# EAGLE design Dramco UNO (EAGLE 7.3.0)

## Sheet 1 of 2
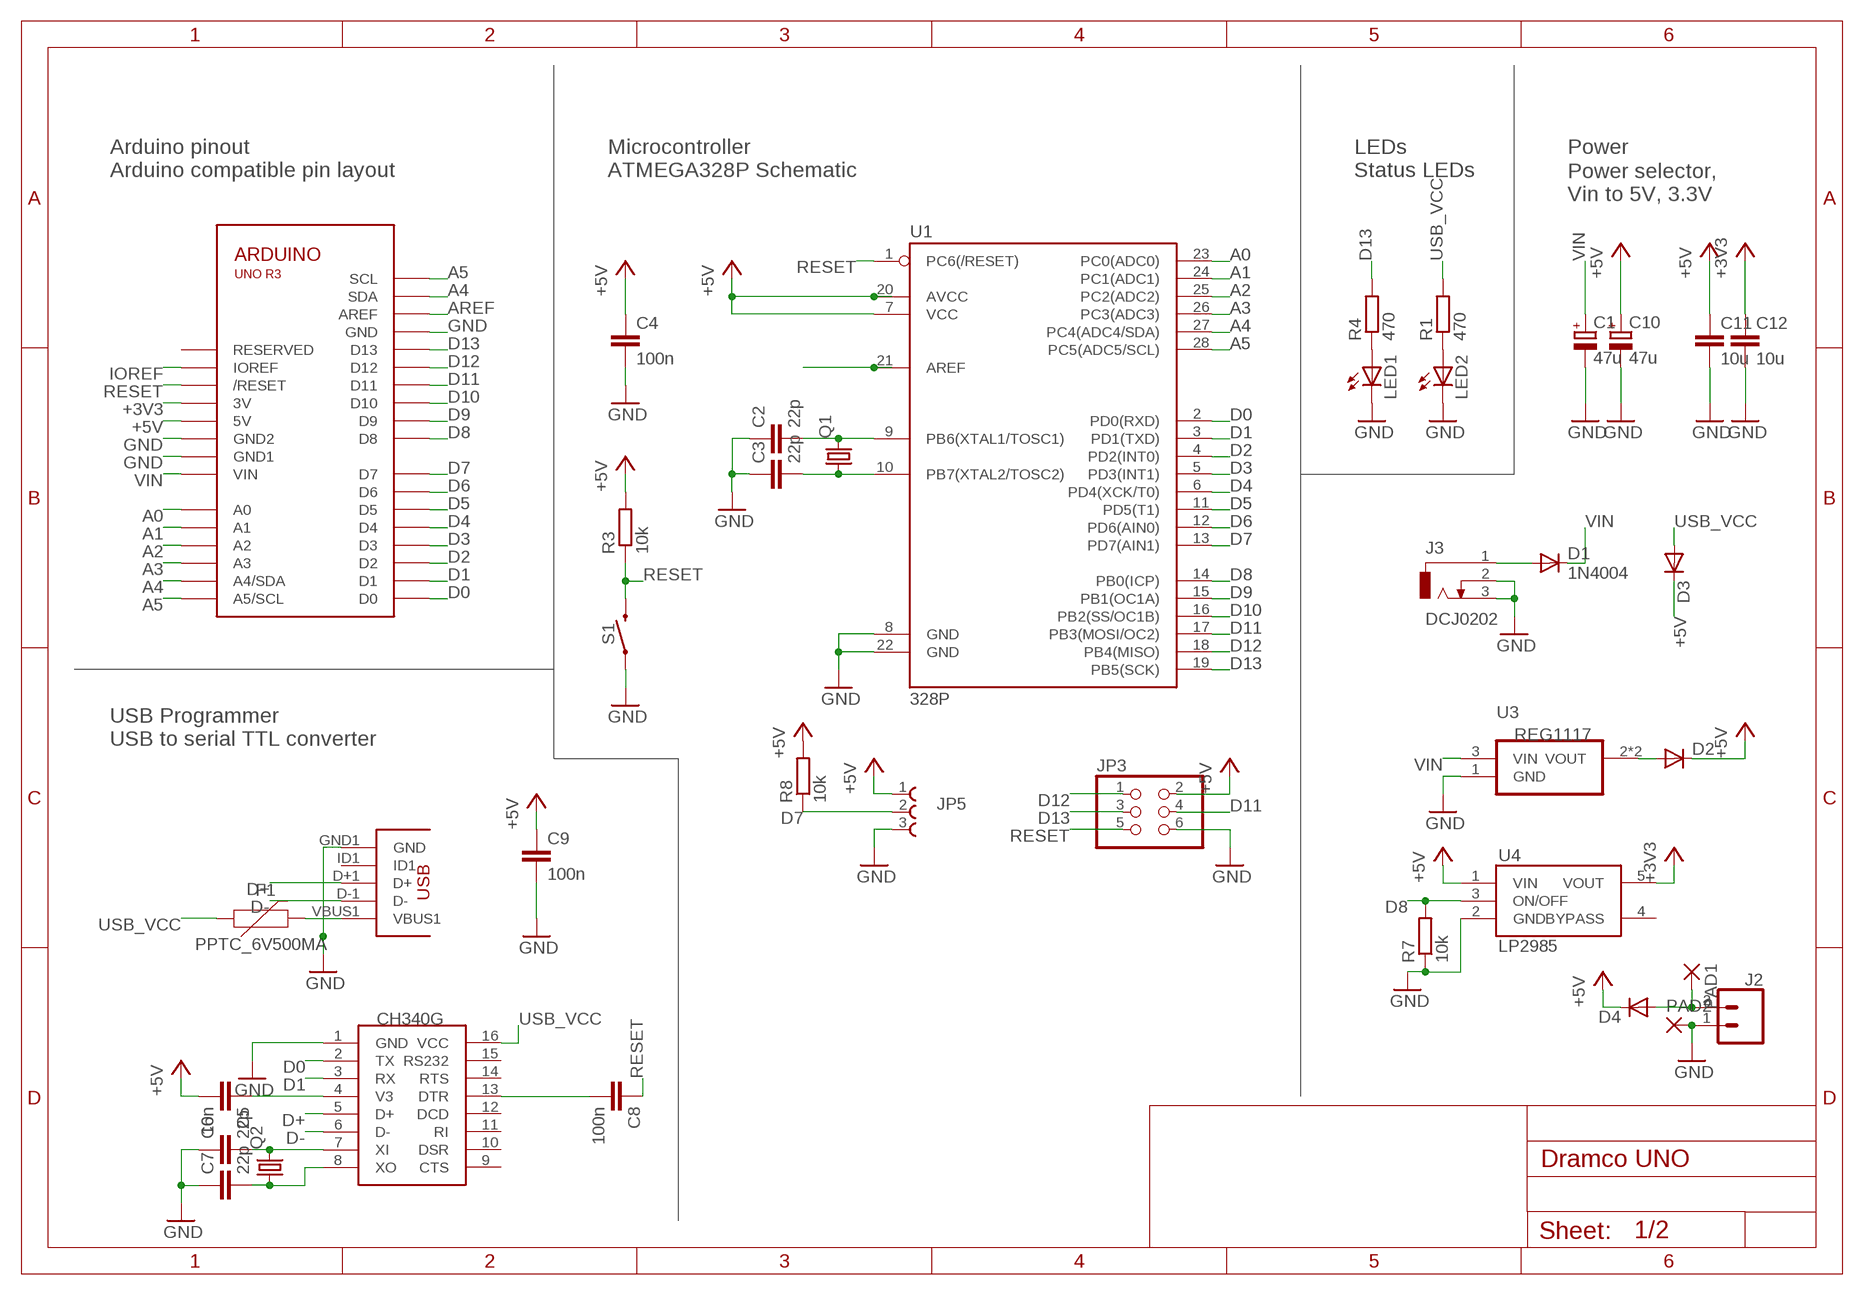
[diagram p0: schematic, sheet 1]

### Parts
C1  47u  CPOL-EUE2.5-6  [E2,5-6]
C2  22p  C-EU025-024X044  [C025-024X044]
C3  22p  C-EU025-024X044  [C025-024X044]
C4  100n  C-EU025-024X044  [C025-024X044]
C5  10n  C-EUC0603  [C0603]
C6  22p  C-EUC0603  [C0603]
C7  22p  C-EUC0603  [C0603]
C8  100n  C-EUC0603  [C0603]
C9  100n  C-EUC0603  [C0603]
C10  47u  CPOL-EUE2.5-6  [E2,5-6]
C11  10u  C-EUC0603  [C0603]
C12  10u  C-EUC0603  [C0603]
D1  1N4004  [DO41-10]
D2  DIODE-SOD123  [SOD123]
D3  DIODE-SOD123  [SOD123]
D4  DIODE-SOD123  [SOD123]
F1  PPTC_6V500MA  [0805]
J1  USB-AB  [USB-AB-MICRO-SMD_V02_BOSS]
J2  CONN_02JST-PTH-2  [JST-2-PTH]
J3  DCJ0202  [DCJ0202]
JP1  ARDUINOR3-DIMENSION  [ARDUINOR3]
JP3  PINHD-2X3  [2X03]
JP5  691210910003  [691210910003]
LED1  LED5MM  [LED5MM]
LED2  LED5MM  [LED5MM]
PAD1  SMD2  [SMD1,27-2,54]
PAD2  SMD2  [SMD1,27-2,54]
Q1  CRYSTALHC49S  [HC49/S]
Q2  CRYSTALHC49S  [HC49/S]
R1  470  R-EU_0204/7  [0204/7]
R3  10k  R-EU_0204/7  [0204/7]
R4  470  R-EU_0204/7  [0204/7]
R7  10k  R-EU_R0603  [R0603]
R8  10k  R-EU_0204/7  [0204/7]
S1  MOMENTARY-SWITCH-SPST-PTH-6.0MM  [TACTILE_SWITCH_PTH_6.0MM]
U1  328P  ATMEGA328P_PDIP  [DIP28]
U2  CH340G  [SOIC16]
U3  REG1117  [SOT223]
U4  LP2985AIM5-3.3  [SOT25]

### Nets
+3V3: C12.1 JP1.3V U4.5(VOUT) ; also sheet 2
+5V: C4.1 C5.2 C9.1 C10.+ C11.1 D2.C D3.C D4.C JP1.5V JP3.2 JP5.1 R3.2 R8.2 U1.7(VCC) U1.20(AVCC) U4.1(VIN) ; also sheet 2
A0: JP1.A0 U1.23(PC0(ADC0))
A1: JP1.A1 U1.24(PC1(ADC1))
A2: JP1.A2 U1.25(PC2(ADC2))
A3: JP1.A3 U1.26(PC3(ADC3))
A4: JP1.A4(A4/SDA) JP1.SDA U1.27(PC4(ADC4/SDA)) ; also sheet 2
A5: JP1.A5(A5/SCL) JP1.SCL U1.28(PC5(ADC5/SCL)) ; also sheet 2
AREF: JP1.AREF U1.21(AREF)
D0: JP1.D0 U1.2(PD0(RXD)) U2.2(TX)
D1: JP1.D1 U1.3(PD1(TXD)) U2.3(RX)
D2: JP1.D2 U1.4(PD2(INT0)) ; also sheet 2
D3: JP1.D3 U1.5(PD3(INT1)) ; also sheet 2
D4: JP1.D4 U1.6(PD4(XCK/T0)) ; also sheet 2
D5: JP1.D5 U1.11(PD5(T1)) ; also sheet 2
D6: JP1.D6 U1.12(PD6(AIN0)) ; also sheet 2
D7: JP1.D7 JP5.2 R8.1 U1.13(PD7(AIN1))
D8: JP1.D8 R7.2 U1.14(PB0(ICP)) U4.3(ON/OFF)
D9: JP1.D9 U1.15(PB1(OC1A)) ; also sheet 2
D10: JP1.D10 U1.16(PB2(SS/OC1B))
D11: JP1.D11 JP3.4 U1.17(PB3(MOSI/OC2)) ; also sheet 2
D12: JP1.D12 JP3.1 U1.18(PB4(MISO)) ; also sheet 2
D13: JP1.D13 JP3.3 R4.2 U1.19(PB5(SCK)) ; also sheet 2
D+: J1.D+1(D+) U2.5(D+)
D-: J1.D-1(D-) U2.6(D-)
GND: C1.- C2.1 C3.1 C4.2 C6.1 C7.1 C9.2 C10.- C11.2 C12.2 J1.GND1(GND) J2.1 J3.2 J3.3 JP1.GND JP1.GND1 JP1.GND2 JP3.6 JP5.3 LED1.K(C) LED2.K(C) PAD2.1(P) R7.1 S1.1 U1.8(GND) U1.22(GND) U2.1(GND) U3.1(GND) U4.2(GND) ; also sheet 2
IOREF: JP1.IOREF
N$1: C2.2 Q1.2 U1.9(PB6(XTAL1/TOSC1))
N$2: C3.2 Q1.1 U1.10(PB7(XTAL2/TOSC2))
N$3: C6.2 Q2.2 U2.7(XI)
N$4: C7.2 Q2.1 U2.8(XO)
N$5: C5.1 U2.4(V3)
N$6: LED1.A R4.1
N$7: LED2.A R1.1
N$8: C8.2 U2.13(DTR)
N$9: D2.A U3.2(VOUT) U3.4(VOUT)
N$10: F1.2 J1.VBUS1
N$13: D1.A J3.1
RESET: C8.1 JP1.RESET(/RESET) JP3.5 R3.1 S1.3 U1.1(PC6(/RESET))
USB_VCC: D3.A F1.1 R1.2 U2.16(VCC)
VBAT: D4.A J2.2 PAD1.1(P)
VIN: C1.+ D1.C JP1.VIN U3.3(VIN)
Unconnected: J1.ID1 JP1.RESERVED U2.9(CTS) U2.10(DSR) U2.11(RI) U2.12(DCD) U2.14(RTS) U2.15(RS232) U4.4(BYPASS)

### Notes on the sheet
- Arduino pinout | Microcontroller | LEDs | Power
- Power selector, 
  Vin to 5V, 3.3V
- Arduino compatible pin layout | ATMEGA328P Schematic | Status LEDs
- USB Programmer
- USB to serial TTL converter

## Sheet 2 of 2
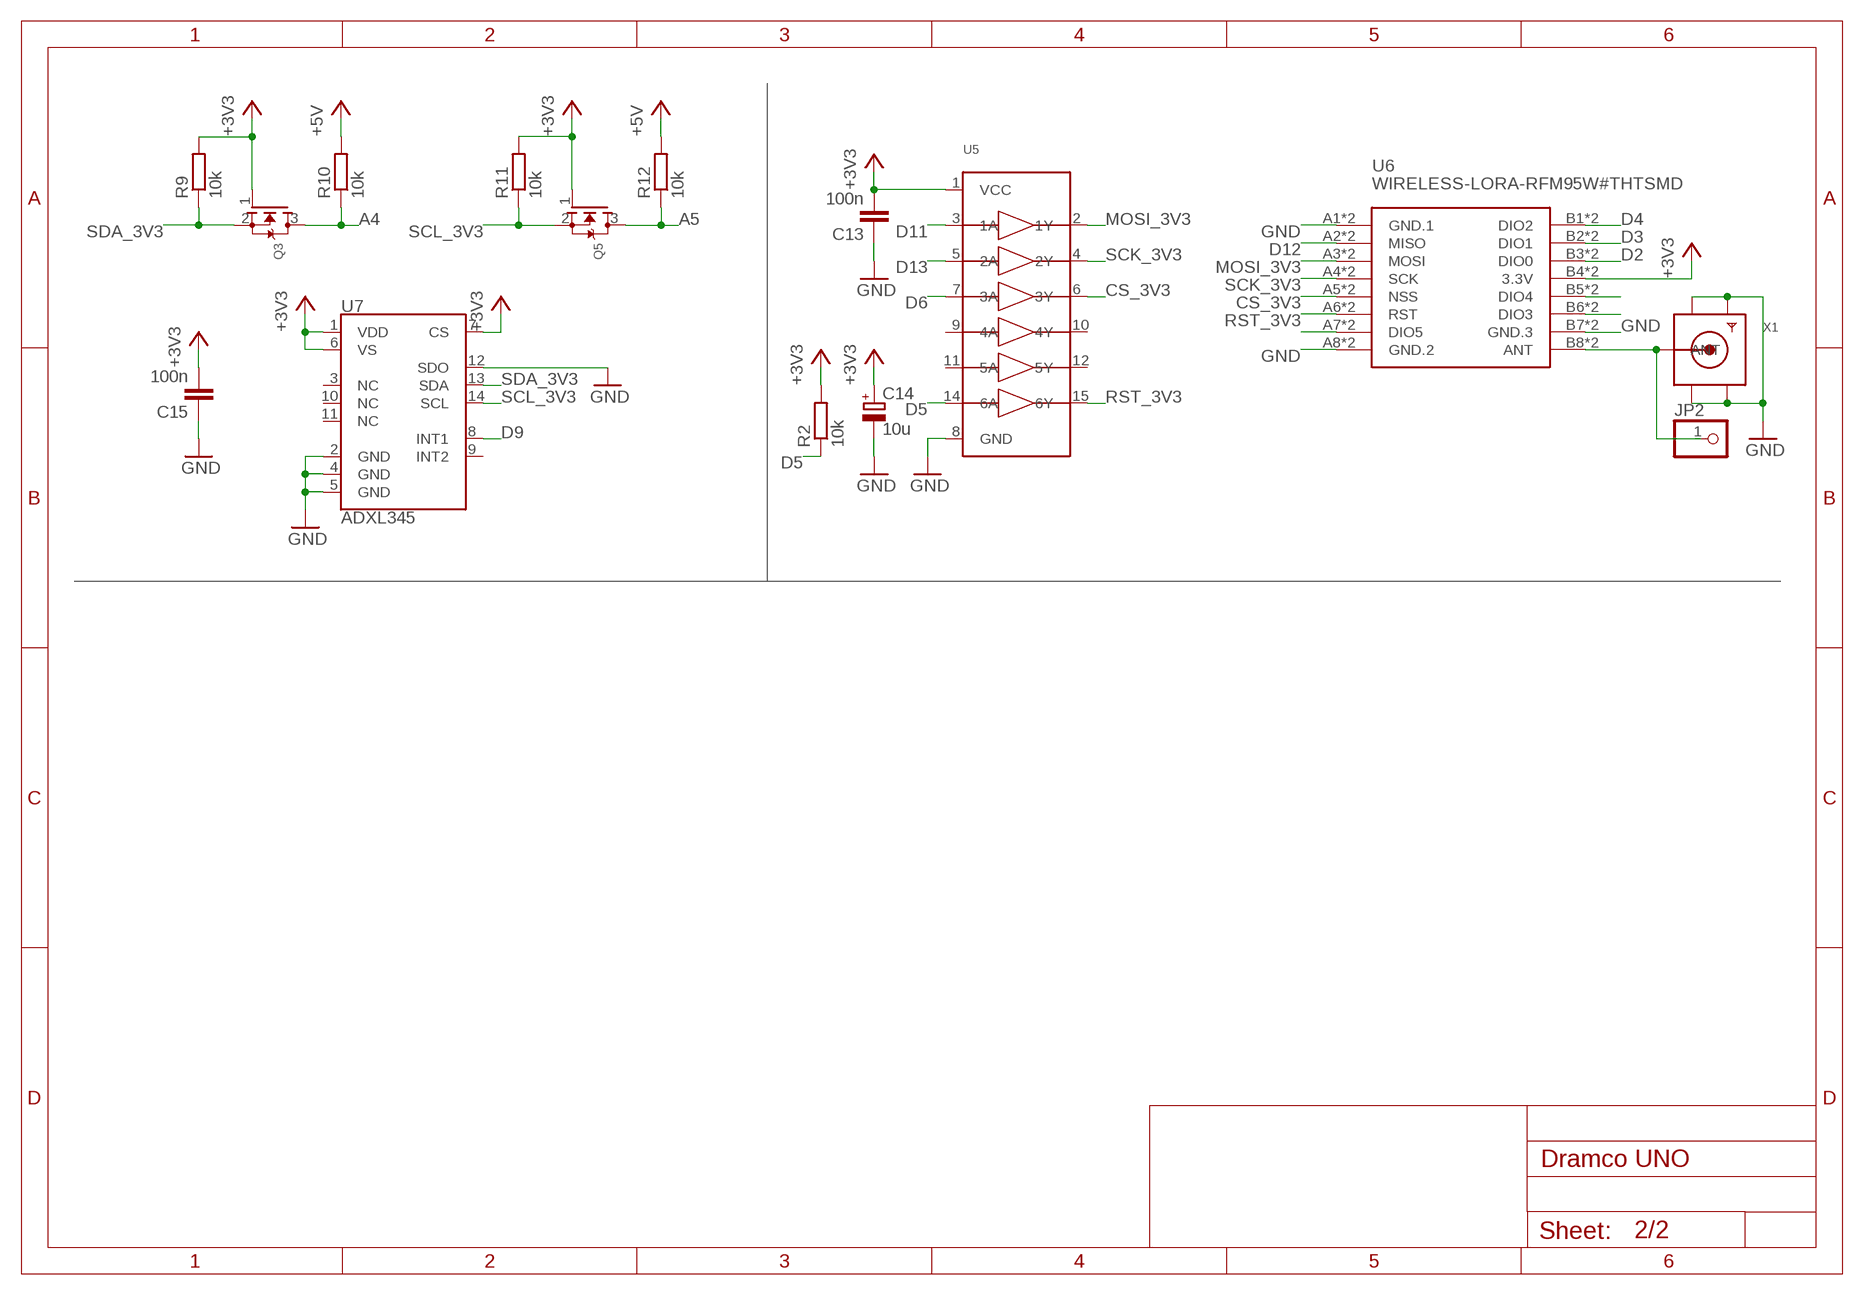
[diagram p1: schematic, sheet 2]

### Parts
C13  100n  C-EUC0603  [C0603]
C14  10u  CPOL-EUE2-4  [E2-4]
C15  100n  C-EUC0603  [C0603]
JP2  PINHD-1X1  [1X01]
Q3  MOSFET-NREFLOW  [SOT23]
Q5  MOSFET-NREFLOW  [SOT23]
R2  10k  R-EU_R0603  [R0603]
R9  10k  R-EU_R0603  [R0603]
R10  10k  R-EU_R0603  [R0603]
R11  10k  R-EU_R0603  [R0603]
R12  10k  R-EU_R0603  [R0603]
U5  74HC4050DTSSOP  [TSSOP16]
U6  WIRELESS-LORA-RFM95W#THTSMD  [WIRELESS-LORA-RFM95W#THTSMD]
U7  ADXL345  [LGA-14]
X1  SMACONNECTOR_EDGE_UFL  [SMA_EDGELAUNCH_UFL]

### Nets
+3V3: C13.2 C14.+ C15.2 Q3.1(G) Q5.1(G) R2.2 R9.2 R11.2 U5.1(VCC) U6.B4(3.3V) U6.B12(3.3V) U7.1(VDD) U7.6(VS) U7.7(CS) ; also sheet 1
+5V: R10.2 R12.2 ; also sheet 1
A4: Q3.3(D) R10.1 ; also sheet 1
A5: Q5.3(D) R12.1 ; also sheet 1
CS_3V3: U5.6(3Y) U6.A5(NSS) U6.A13(NSS)
D2: U6.B3(DIO0) U6.B11(DIO0) ; also sheet 1
D3: U6.B2(DIO1) U6.B10(DIO1) ; also sheet 1
D4: U6.B1(DIO2) U6.B9(DIO2) ; also sheet 1
D5: R2.1 U5.14(6A) ; also sheet 1
D6: U5.7(3A) ; also sheet 1
D9: U7.8(INT1) ; also sheet 1
D11: U5.3(1A) ; also sheet 1
D12: U6.A2(MISO) U6.A10(MISO) ; also sheet 1
D13: U5.5(2A) ; also sheet 1
GND: C13.1 C14.- C15.1 U5.8(GND) U6.A1(GND.1) U6.A8(GND.2) U6.A9(GND.1) U6.A16(GND.2) U6.B7(GND.3) U6.B15(GND.3) U7.2(GND) U7.4(GND) U7.5(GND) U7.12(SDO) X1.GND@1(GND1) X1.GND@2(GND2) X1.GND@3(GND3) X1.GND@4(GND4) ; also sheet 1
MOSI_3V3: U5.2(1Y) U6.A3(MOSI) U6.A11(MOSI)
N$11: JP2.1 U6.B8(ANT) U6.B16(ANT) X1.P(ANT)
N$25: U6.A7(DIO5) U6.A15(DIO5)
N$30: U6.B5(DIO4) U6.B13(DIO4)
N$31: U6.B6(DIO3) U6.B14(DIO3)
RST_3V3: U5.15(6Y) U6.A6(RST) U6.A14(RST)
SCK_3V3: U5.4(2Y) U6.A4(SCK) U6.A12(SCK)
SCL_3V3: Q5.2(S) R11.1 U7.14(SCL)
SDA_3V3: Q3.2(S) R9.1 U7.13(SDA)
Unconnected: U5.9(4A) U5.10(4Y) U5.11(5A) U5.12(5Y) U7.3(NC) U7.9(INT2) U7.10(NC) U7.11(NC)

## Library data of the parts
C1 C10 C14 = rcl:CPOL-EU: POLARIZED CAPACITOR, European symbol
C2-C9 = resistor:C-EU: CAPACITOR, European symbol
C11-C13 C15 = rcl:C-EU: CAPACITOR, European symbol
D1 = diode:1N4004: DIODE general purpose rectifier, 1 A
D2-D4 = diode:DIODE-: DIODE
F1 = SparkFun-Fuses:PPTC: Resettable Fuse PPTC Resettable Fuse. Really a sort of resistor with a polymeric positive temperature coefficient whose resistance increases dramatically with an increase in temperature. When heated by the power passing through the resistance rises causing the current to be limited, protecting the circuit. This is achieved by the transition of the polymer from a crystalline to an amorphous state where the conductive carbon separates breaking the conductive pathways found in the cool crystalline structure. When a PPTC cools back down it resumes conducting letting the circuit turn back on. SparkFun Products: SparkFun RedBoard - Programmed with Arduino <https://www.sparkfun.com/products/12757> Pro Micro - 5V/16MHz <https://www.sparkfun.com/products/12640> Arduino Pro 328 - 5V/16MHz <https://www.sparkfun.com/products/10915> MP3 Trigger <https://www.sparkfun.com/products/13720>
J1 = Testing:USB-AB
J2 = SparkFun-Connectors:CONN_02: Multi connection point. Often used as Generic Header-pin footprint for 0.1 inch spaced/style header connections On any of the 0.1 inch spaced packages, you can populate with these: Break Away Headers - Straight <https://www.sparkfun.com/products/116> (PRT-00116) Break Away Male Headers - Right Angle <https://www.sparkfun.com/products/553> (PRT-00553) Female Headers <https://www.sparkfun.com/products/115> (PRT-00115) Break Away Headers - Machine Pin <https://www.sparkfun.com/products/117> (PRT-00117) Break Away Female Headers - Swiss Machine Pin <https://www.sparkfun.com/products/743> (PRT-00743) For SCREWTERMINALS and SPRING TERMINALS visit here: Screw Terimnals on SparkFun.com <https://www.sparkfun.com/search/results?term=Screw+Terminals> (5mm/3.5mm/2.54mm spacing) This device is also useful as a general connection point to wire up your design to another part of your project. Our various solder wires solder well into these plated through hole pads. Hook-Up Wire - Assortment (Stranded, 22 AWG) <https://www.sparkfun.com/products/11375> (PRT-11375) Hook-Up Wire - Assortment (Solid Core, 22 AWG) <https://www.sparkfun.com/products/11367> (PRT-11367) View the entire wire category on our website here <https://www.sparkfun.com/categories/141> Special notes: Molex polarized connector foot print use with: PRT-08233 with associated crimp pins and housings. 2.54_SCREWTERM for use with PRT-10571. 3.5mm Screw Terminal footprints for PRT-08084 5mm Screw Terminal footprints for use with PRT-08432; PROD_ID: CONN-09863; SKU: PRT-09914
J3 = con-jack:DCJ0202: DC POWER JACK Source: DCJ0202.pdf; OC_FARNELL: unknown; OC_NEWARK: unknown
JP1 = adafruit:ARDUINOR3: This is a new object for the new Arduino R3 - with extra pins that you may want to use (such as IOref, and duplicated A4/A5
JP2 = pinhead:PINHD-1X1: PIN HEADER
JP3 = pinhead:PINHD-2X3: PIN HEADER
JP5 = TerminalBlocks (rev17a):691210910003: WR-TBL Serie 2109 - 2.54mm Horizontal Entry Modular with Rising Cage Clamp - 0.8mm2 Wires, 3 Pins=>Code : Con_TBL_Screw_RisingClamp_2.54_691210910003 <http://katalog.we-online.de/media/images/eican/Con_TBL_Screw_RisingClamp_2.54_6912109100xx_pf2.jpg> Details see: http://katalog.we-online.de/en/em/TBL_2_54_2109_HORIZONTAL_ENTRY_69121091000X Created 2014-06-17, Karrer Zheng 2014 (C) Würth Elektronik
LED1 LED2 = adafruit:LED: LED OSRAM: - CHIPLED LG R971, LG N971, LY N971, LG Q971, LY Q971, LO R971, LY R971 LH N974, LH R974 LS Q976, LO Q976, LY Q976 LO Q996 - Hyper CHIPLED LW Q18S LB Q993, LB Q99A, LB R99A - SideLED LS A670, LO A670, LY A670, LG A670, LP A670 LB A673, LV A673, LT A673, LW A673 LH A674 LY A675 LS A676, LA A676, LO A676, LY A676, LW A676 LS A679, LY A679, LG A679 - Hyper Micro SIDELED® LS Y876, LA Y876, LO Y876, LY Y876 LT Y87S - SmartLED LW L88C, LW L88S LB L89C, LB L89S, LG L890 LS L89K, LO L89K, LY L89K LS L896, LA L896, LO L896, LY L896 - TOPLED LS T670, LO T670, LY T670, LG T670, LP T670 LSG T670, LSP T670, LSY T670, LOP T670, LYG T670 LG T671, LOG T671, LSG T671 LB T673, LV T673, LT T673, LW T673 LH T674 LS T676, LA T676, LO T676, LY T676, LB T676, LH T676, LSB T676, LW T676 LB T67C, LV T67C, LT T67C, LS T67K, LO T67K, LY T67K, LW E67C LS E67B, LA E67B, LO E67B, LY E67B, LB E67C, LV E67C, LT E67C LW T67C LS T679, LY T679, LG T679 LS T770, LO T770, LY T770, LG T770, LP T770 LB T773, LV T773, LT T773, LW T773 LH T774 LS E675, LA E675, LY E675, LS T675 LS T776, LA T776, LO T776, LY T776, LB T776 LHGB T686 LT T68C, LB T68C - Hyper Mini TOPLED® LB M676 - Mini TOPLED Santana® LG M470 LS M47K, LO M47K, LY M47K Source: http://www.osram.convergy.de/
PAD1 PAD2 = wirepad:SMD2: SMD PAD
Q1 Q2 = adafruit:CRYSTAL: CRYSTAL; OC_FARNELL: 1667008; OC_NEWARK: unknown
Q3 Q5 = adafruit:MOSFET-N: N-Channel Mosfet 2N7002E - 60V 260mA SOT23 [Digikey: 2N7002ET1GOSTR-ND] - REEL BSH103 - 30V 850mA SOT23 [Digikey: 568-5013-1-ND]
R1 R3 R4 R8 = resistor:R-EU_: RESISTOR, European symbol
R2 R7 R9-R12 = rcl:R-EU_: RESISTOR, European symbol
S1 = SparkFun-Switches:MOMENTARY-SWITCH-SPST: Momentary Switch (Pushbutton) - SPST Normally-open (NO) SPST momentary switches (buttons, pushbuttons). Variants PTH-12MM - 12mm square, through-hole Momentary Pushbutton Switch - 12mm Square <https://www.sparkfun.com/products/9190> (COM-09190) PTH-6.0MM, PTH-6.0MM-KIT - 6.0mm square, through-hole Mini Pushbutton Switch <https://www.sparkfun.com/products/97> (COM-00097) KIT package intended for soldering kit's - only one side of pads' copper is exposed. PTH-RIGHT-ANGLE-KIT - Right-angle, through-hole Right Angle Tactile Button <https://www.sparkfun.com/products/10791> - Used on SparkFun BigTime Watch Kit <https://www.sparkfun.com/products/11734> SMD-12MM - 12mm square, surface-mount Tactile Button - SMD (12mm) <https://www.sparkfun.com/products/12993> (COM-12993) Used on SparkFun PicoBoard <https://www.sparkfun.com/products/11888> SMD-4.5MM - 4.5mm Square Trackball Switch Used on SparkFun Blackberry Trackballer Breakout <https://www.sparkfun.com/products/13169> SMD-4.6MMX2.8MM - 4.60mm x 2.80mm, surface mount Used on SparkFun SAMD21 Mini Breakout <https://www.sparkfun.com/products/13664> SMD-5.2MM, SMD-5.2-REDUNDANT - 5.2mm square, surface-mount Mini Pushbutton Switch - SMD <https://www.sparkfun.com/products/8720> (COM-08720) Used on Arduino Pro Mini <https://www.sparkfun.com/products/11114> REDUNDANT package connects both switch circuits together SMD-6.0X3.5MM - 6.0 x 3.5mm, surface mount Momentary Reset Switch SMD <https://www.sparkfun.com/products/8229> (COM-08229) SMD-6.2MM-TALL - 6.2mm square, surface mount Tactile Button - SMD (6mm) <https://www.sparkfun.com/products/12992> Used on SparkFun Digital Sandbox <https://www.sparkfun.com/products/12651> SMD-RIGHT-ANGLE - Right-angle, surface mount Used on SparkFun Block for Intel® Edison - Arduino <https://www.sparkfun.com/products/13036>; PROD_ID: SWCH-08441; SF_SKU: COM-00097
U1 = SparkFun-IC-Microcontroller:ATMEGA328P_PDIP: Atmel 328P Through hole ATMEGA328P uC used in the Arduino 32kb flash, 1k EEPROM, 2k SRAM Datasheet <http://www.sparkfun.com/datasheets/Components/SMD/ATMega328.pdf> SparkFun Products Storefront component: AVR 28 Pin 20MHz 32K 6A/D - ATMega328P <https://www.sparkfun.com/products/9061> (COM-09061) SparkFun Simon Says - Through-Hole Soldering Kit <https://www.sparkfun.com/products/10547> (KIT-10547) SparkFun Learn to Solder - Simon Says <https://www.sparkfun.com/products/13708> (KIT-13708) SparkFun BigTime Watch Kit <https://www.sparkfun.com/products/11734> (KIT-11734) SparkFun ClockIt <https://www.sparkfun.com/products/10930> (KIT-10930) SparkFun Serial Enabled LCD Kit <https://www.sparkfun.com/products/10097> (LCD-10097) SparkFun Simon Tilts - Through Hole Soldering Kit <https://www.sparkfun.com/products/12634> (KIT-12634) SparkFun Frequency Counter Kit <https://www.sparkfun.com/products/10140> (KIT-10140) FabFM Radio Kit <https://www.sparkfun.com/products/11043> (KIT-11043) SparkFun Binary Blaster Kit <https://www.sparkfun.com/products/12037> (KIT-12037) SparkFun Metro-Gnome <https://www.sparkfun.com/products/9236> (KIT-09236) ATmega328 with Arduino Optiboot (Uno) <https://www.sparkfun.com/products/10524> (DEV-10524); PROD_ID: IC-09136
U2 = ch340g:CH340G
U3 = burr-brown:REG1117: 800mA and 1A Low Dropout (LDO) Positive Regulator 1.8V, 2.5V, 2.85V, 3.3V, 5V, and Adj; MPN: REG1117; OC_FARNELL: 1097566; OC_NEWARK: 14P6981
U4 = LP2985:LP2985: LP2985-N Micropower 150 mA Low-Noise Ultra Low-Dropout Regulator
U5 = microbuilder:74HC4050D: 6-channel level shifter 74HC4050D - 2V-6V Supply SOIC16 Digikey: 74HC4050D,653-ND Mouser: 771-74HC4050D-T TSSOP16 Digikey: 296-9215-1-ND Mouser:
U6 = diy-modules:WIRELESS-LORA-RFM95W: 868/915 MHz LoRa Radio Transceiver Module based on SX1276 chip Click here to find device on ebay.com <http://www.ebay.com/sch/RFM95W+transceiver>
U7 = SparkFun-Sensors:ADXL345: Analog Devices ADXL345 3-Axis SPI/I2C 2/4/8/16g Accelerometer The ADXL345 is a small, thin, low power, 3-axis accelerometer with high resolution (13-bit) measurement at up to ±16g. Digital output data is formatted as 16-bit twos complement and is accessible through either a SPI (3- or 4-wire) or I2C digital interface. Datasheet <https://www.sparkfun.com/datasheets/Sensors/Accelerometer/ADXL345.pdf> SparkFun Products SparkFun Triple Axis Accelerometer Breakout - ADXL345 <https://www.sparkfun.com/products/9836> (SEN-09836) Triple Axis Accelerometer - ADXL345 <https://www.sparkfun.com/products/9045> (SEN-09045) SparkFun 6 Degrees of Freedom IMU Digital Combo Board - ITG3200/ADXL345 <https://www.sparkfun.com/products/10121> (SEN-10121); PROD_ID: IC-09097; SF_ID: SEN-09045
X1 = adafruit:SMACONNECTOR: SMA Connector 90° DIP SMA Connector, 50 Ohm (4UConnector: 07259)

## Net classes
0 default: clearance 0.205 mm

## Board
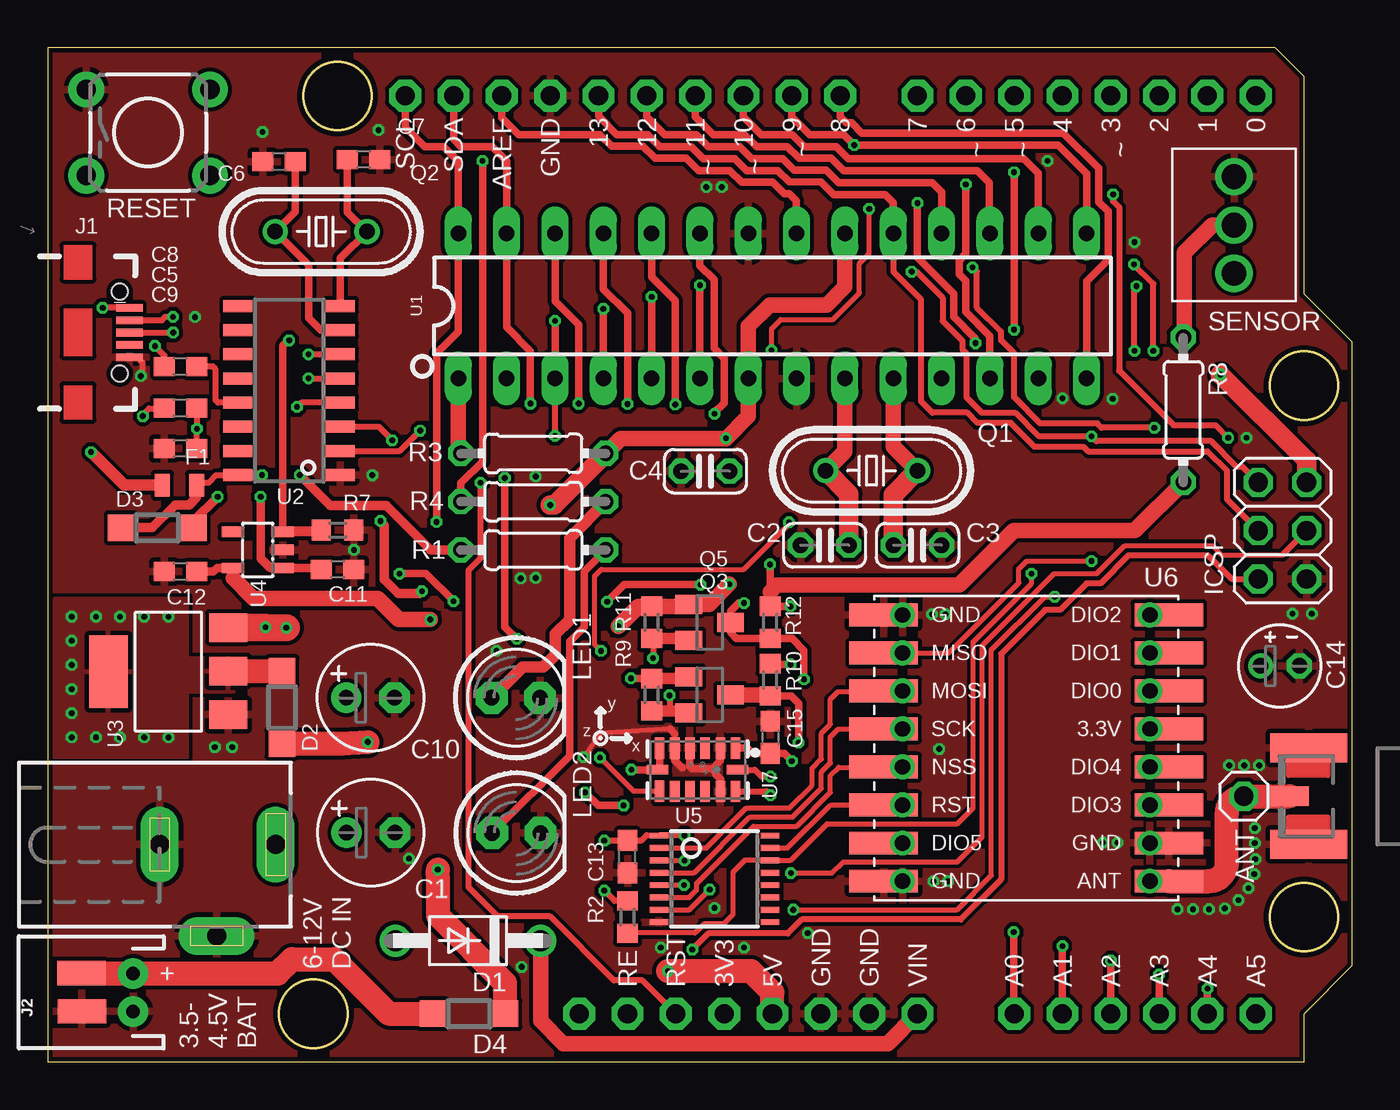
[diagram p2: board, top side]
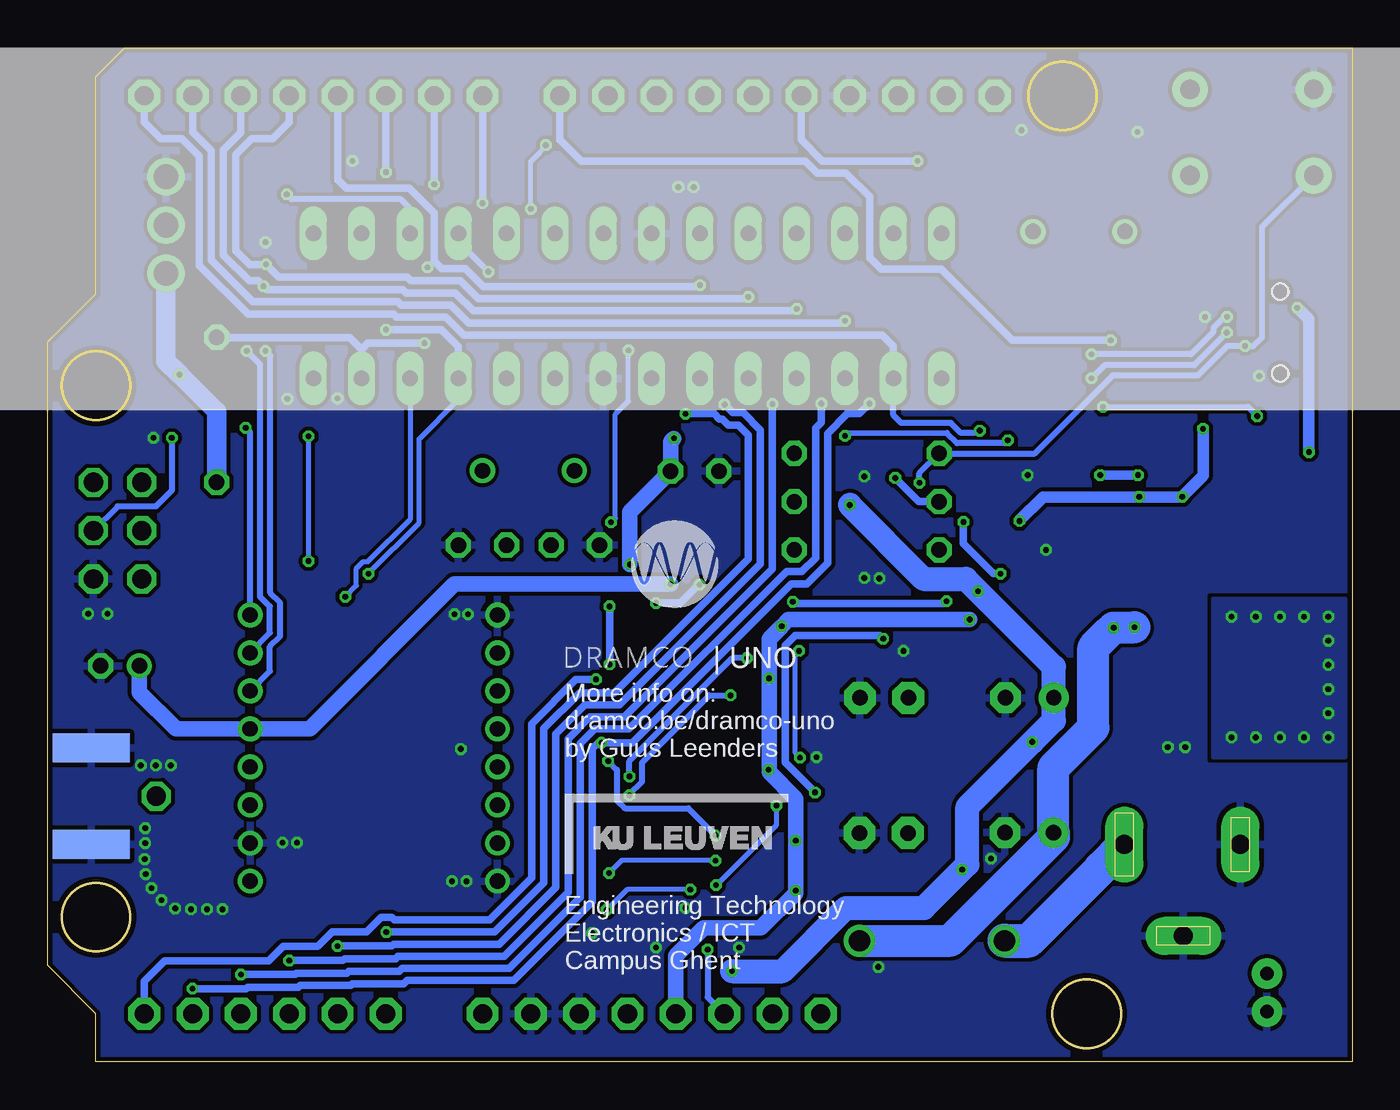
[diagram p3: board, bottom side, seen from below]

Size 68.58 x 53.34 mm. Coordinates in mm from the lower left corner, seen from the top.
Copper layers (1*16): Top 0.035mm / dielectric 1.5mm / Bottom 0.035mm
Design rules "SeeedStudio_2layer_DRU_no_angle_20140221": minimum track width 6mil, minimum drill 12mil, track to track 6mil, track to pad 6mil, pad to pad 6mil, via to via 6mil, smd to smd 0mil, copper to edge 10mil, drill to drill 10mil, minimum pad ring 10mil, minimum via ring 6mil, stop-mask expansion 2mil, vias tented up to drill 100mil, thermal gap 10mil

### Footprints (pad centres in the part's own frame; a part is rotated, then mirrored left to right if it is on the bottom)
E2,5-6 = drill 0.813 pad 1.6: + -1.27,0 | drill 0.813 pad 1.6 octagon: - 1.27,0
C025-024X044 = drill 0.813 octagon: 1 -1.27,0; 2 1.27,0
C0603 = smd 1.1 x 1: 1 -0.85,0; 2 0.85,0
E2-4 = drill 0.813 pad 1.27: + -1.016,0 | drill 0.813 pad 1.27 octagon: - 1.016,0
DO41-10 = drill 1.118: A 3.81,0; C -3.81,0
SOD123 = smd 1.4 x 1.4: A 1.9,0; C -1.9,0
0805 = smd 0.8 x 1.2: 1 -0.9,0; 2 0.9,0
USB-AB-MICRO-SMD_V02_BOSS = smd 1.4 x 0.4: D+1 2.7,0; D-1 2.7,0.65; GND1 2.7,-1.3; ID1 2.7,-0.65; VBUS1 2.7,1.3 | hole 0.85: 2.2,2.154; 2.2,-2.154
JST-2-PTH = drill 0.7 pad 1.6: 1 -1,0; 2 1,0
DCJ0202 = drill 1 pad 2 long: 1 0,3.1; 2 4.8,0; 3 0,-3
ARDUINOR3 = drill 1 pad 1.676 octagon: 3V 35.56,2.54; 5V 38.1,2.54; A0 50.8,2.54; A1 53.34,2.54; A2 55.88,2.54; A3 58.42,2.54; A4 60.96,2.54; A5 63.5,2.54; AREF 23.876,50.8; D0 63.5,50.8; D1 60.96,50.8; D2 58.42,50.8; D3 55.88,50.8; D4 53.34,50.8; D5 50.8,50.8; D6 48.26,50.8; D7 45.72,50.8; D8 41.656,50.8; D9 39.116,50.8; D10 36.576,50.8; D11 34.036,50.8; D12 31.496,50.8; D13 28.956,50.8; GND 26.416,50.8; GND1 43.18,2.54; GND2 40.64,2.54; IOREF 30.48,2.54; RESERVED 27.94,2.54; RESET 33.02,2.54; SCL 18.796,50.8; SDA 21.336,50.8; VIN 45.72,2.54
1X01 = drill 1.016 octagon: 1 0,0
2X03 = drill 1.016 octagon: 1 -2.54,-1.27; 2 -2.54,1.27; 3 0,-1.27; 4 0,1.27; 5 2.54,-1.27; 6 2.54,1.27
691210910003 = drill 1.3: 1 -2.54,0; 2 0,0; 3 2.54,0
LED5MM = drill 0.813 pad 1.676 octagon: A -1.27,0; K 1.27,0
SMD1,27-2,54 = smd 1.27 x 2.54: 1 0,0
HC49/S = drill 0.813: 1 -2.413,0; 2 2.413,0
SOT23 = smd 1 x 1.4: 1 -0.95,-1.1; 2 0.95,-1.1; 3 0,1.1
0204/7 = drill 0.813 octagon: 1 -3.81,0; 2 3.81,0
R0603 = smd 1 x 1.1: 1 -0.85,0; 2 0.85,0
TACTILE_SWITCH_PTH_6.0MM = drill 1.016 pad 1.88: 1 -3.251,2.261; 2 3.251,2.261; 3 -3.251,-2.261; 4 3.251,-2.261
DIP28 = drill 0.813 pad 1.422 long: 1 -16.51,-3.81; 2 -13.97,-3.81; 3 -11.43,-3.81; 4 -8.89,-3.81; 5 -6.35,-3.81; 6 -3.81,-3.81; 7 -1.27,-3.81; 8 1.27,-3.81; 9 3.81,-3.81; 10 6.35,-3.81; 11 8.89,-3.81; 12 11.43,-3.81; 13 13.97,-3.81; 14 16.51,-3.81; 15 16.51,3.81; 16 13.97,3.81; 17 11.43,3.81; 18 8.89,3.81; 19 6.35,3.81; 20 3.81,3.81; 21 1.27,3.81; 22 -1.27,3.81; 23 -3.81,3.81; 24 -6.35,3.81; 25 -8.89,3.81; 26 -11.43,3.81; 27 -13.97,3.81; 28 -16.51,3.81
SOIC16 = smd 0.635 x 1.524: 1 -4.445,-2.695; 2 -3.175,-2.695; 3 -1.905,-2.695; 4 -0.635,-2.695; 5 0.635,-2.695; 6 1.905,-2.695; 7 3.175,-2.695; 8 4.445,-2.695; 9 4.445,2.695; 10 3.175,2.695; 11 1.905,2.695; 12 0.635,2.695; 13 -0.635,2.695; 14 -1.905,2.695; 15 -3.175,2.695; 16 -4.445,2.695
SOT223 = smd 1.499 x 2.007: 1 -2.261,-3.15; 2 0.025,-3.15; 3 2.311,-3.15 | smd 3.81 x 2.007: 4 0,3.15
SOT25 = smd 0.55 x 1.2: 1 -0.95,-1.3; 2 0,-1.3; 3 0.95,-1.3; 4 0.95,1.3; 5 -0.95,1.3
TSSOP16 = smd 0.305 x 0.991: 1 -2.275,-2.918; 2 -1.625,-2.918; 3 -0.975,-2.918; 4 -0.325,-2.918; 5 0.325,-2.918; 6 0.975,-2.918; 7 1.625,-2.918; 8 2.275,-2.918; 9 2.275,2.918; 10 1.625,2.918; 11 0.975,2.918; 12 0.325,2.918; 13 -0.325,2.918; 14 -0.975,2.918; 15 -1.625,2.918; 16 -2.275,2.918
WIRELESS-LORA-RFM95W#THTSMD = smd 3.6 x 1.2: A1 -7.5,7; A2 -7.5,5; A3 -7.5,3; A4 -7.5,1; A5 -7.5,-1; A6 -7.5,-3; A7 -7.5,-5; A8 -7.5,-7; B1 7.5,7; B2 7.5,5; B3 7.5,3; B4 7.5,1; B5 7.5,-1; B6 7.5,-3; B7 7.5,-5; B8 7.5,-7 | drill 0.8: A9 -6.5,7; A10 -6.5,5; A11 -6.5,3; A12 -6.5,1; A13 -6.5,-1; A14 -6.5,-3; A15 -6.5,-5; A16 -6.5,-7; B9 6.5,7; B10 6.5,5; B11 6.5,3; B12 6.5,1; B13 6.5,-1; B14 6.5,-3; B15 6.5,-5; B16 6.5,-7
LGA-14 = smd 0.5 x 1.124: 1 2,1.138; 2 1.2,1.138; 3 0.4,1.138; 4 -0.4,1.138; 5 -1.2,1.138; 6 -2,1.138; 8 -2,-1.13; 9 -1.2,-1.138; 10 -0.4,-1.138; 11 0.4,-1.138; 12 1.2,-1.138; 13 2,-1.138 | smd 1.124 x 0.5: 7 -2.1,0; 14 2.1,0
SMA_EDGELAUNCH_UFL = smd 4.064 x 1.524: GND@1 2.032,-2.54; GND@2 2.032,2.54 | smd 4.064 x 1.524 bottom: GND@3 2.032,2.54; GND@4 2.032,-2.54 | smd 2.032 x 1.016: P 3.048,0

### Placement (x,y rotation side)
C1  16.99,12.06 0 top
C2  40.84,27.18 0 top
C3  45.72,27.18 180 top
C4  34.57,31.06 180 top
C5  6.99,34.39 0 top
C6  12.17,47.35 0 top
C7  16.61,47.45 180 top
C8  6.99,36.58 0 top
C9  6.99,32.26 180 top
C10  16.97,19.15 0 top
C11  15.24,25.91 0 top
C12  6.99,25.78 180 top
C13  30.48,10.79 90 top
C14  64.77,20.83 0 top
C15  37.97,17.07 270 top
D1  22.1,6.38 180 top
D2  12.32,18.64 90 top
D3  5.77,28.09 180 top
D4  22.15,2.54 180 top
F1  6.93,30.33 180 top
J1  1.6,38.35 0 top
J2  4.5,3.66 90 top
J3  8.89,11.43 270 top
JP1  0,0 0 top
JP2  62.87,13.97 0 top
JP3  64.9,27.94 270 top
JP5  62.36,44.01 90 top
LED1  24.61,19.15 0 top
LED2  24.64,12.04 0 top
PAD1  1.78,4.67 90 top
PAD2  1.8,2.67 90 top
Q1  43.31,31.09 180 top
Q2  14.38,43.66 180 top
Q3  34.8,19.3 270 top
Q5  34.8,23.11 270 top
R1  25.53,26.92 180 top
R2  30.48,7.62 90 top
R3  25.53,32 0 top
R4  25.53,29.46 180 top
R7  15.24,27.97 180 top
R8  59.69,34.29 270 top
R9  31.75,19.3 90 top
R10  37.97,20.09 90 top
R11  31.75,23.11 90 top
R12  37.97,23.11 90 top
S1  5.28,48.87 0 top
U1  38.1,39.75 0 top
U2  12.7,35.31 90 top
U3  6.35,20.52 90 top
U4  11.05,26.92 90 top
U5  35.05,9.63 270 top
U6  51.44,16.51 0 top
U7  34.16,15.37 0 top
X1  68.31,13.97 180 top

### Tracks (layer width: path | path; a pad name or v marks a point on that pad's centre or on a via)
+3V3  (via drill 0.3)
  Top 0.305: 30.49,11.63 C13.2 | C13.2 31.19,11.63 31.48,11.93 U5.1 32.15,11.91 v33.48,11.91 | C13.2 v29.26,11.63 | R2.2 29.81,8.47 v29.26,9.02
  Top 0.406: U7.1 36.78,16.5 37.06,16.23 37.96,16.23 | 37.96,16.23 C15.2 | v30.68,15.37 U7.7 32.16,15.47 U7.6 | 9.75,25.45 U4.5 | 37.96,16.23 38.71,16.23 v39.12,15.82 | R9.2 30.77,20.15 v30.66,20.17
  Top 0.457: U4.5 8.9,25.97 8.71,25.78 C12.1
  Top 0.61: 33.6,23.96 Q5.1 | R9.2 33.6,20.15 Q3.1
  Top 0.813: 33.2,23.96 R11.2 31.05,23.96 v30,22.91 | 33.2,23.96 33.6,23.96 | U6.B12 U6.B4 | v35.84,25.12 34.77,24.05 33.29,24.05 33.2,23.96 | v20.12,23.27 18.47,23.27 17.35,24.38 10.82,24.38 9.75,25.45
  Bottom 0.305: v33.48,11.91 34.9,13.34 38.25,13.34 38.66,13.74 38.66,15.37 v39.12,15.82
  Bottom 0.406: v30.68,15.37 30.68,15.27 30.66,15.24
  Bottom 0.813: v20.12,23.27 29.64,23.27 v30,22.91 30.66,22.25 v30.66,20.17 30.66,15.24 29.26,13.84 v29.26,11.63 v29.26,9.02 29.26,8.87 31.09,7.06 34.09,7.06 35.56,5.59 JP1.3V | C14.+ 63.75,19.43 61.82,17.5 U6.B12 | U6.B12 | v35.84,25.12 47.19,25.12 54.81,17.5 U6.B12
+5V  (via drill 0.3)
  Top 0.305: 11.23,29.74 v11.2,29.72 | C5.2 7.83,33.31 v7.85,33.3 7.83,33.29 C9.1
  Top 0.406: v39.04,23.95 39.03,23.96 R12.2 37.97,24.71 v37.97,26.16 | v39.04,20.9 37.99,20.9 R10.2
  Top 0.457: v11.2,29.72 11.2,26.47 11.69,25.97 U4.1 14.38,25.97 C11.1
  Top 0.508: D3.C 7.67,28.44 v8.94,29.72 | 17.5,28.42 17.7,28.22 17.7,25.38 18.44,24.64 19.56,24.64 v19.67,24.75
  Top 0.61: v17.5,28.45 17.5,28.42
  Top 0.813: U1.20 41.91,40.77 40.95,39.8 37.95,39.8 36.83,38.68 U1.7 36.83,33.96 v35.66,32.79 30.12,32.79 R3.2 | R8.2 57.15,27.94 50.77,27.94 47.9,25.07 38.33,25.07 37.97,24.71
  Top 1.016: v26.42,29.29 26.62,29.29 R3.2 | JP3.2 66.17,31.62 v61.65,36.14
  Top 1.27: JP1.5V 38.1,3.66 36.98,4.78 v32.6,4.78 | D2.C 15.47,16.74 v16.83,16.83 | D4.C 24.05,4.14 20.52,7.7 20.52,9.45 v20.51,10.12
  Top 1.422: 15.62,19.07 C10.+
  Bottom 0.305: v7.85,33.3 7.85,33.07
  Bottom 0.406: v39.04,23.95 v39.04,20.9
  Bottom 0.61: v17.5,28.45 17.5,28.47 16.26,29.72 v11.2,29.72 v8.94,29.72 8.94,29.74 7.85,30.84 v7.85,33.3
  Bottom 0.813: v37.97,26.16 37.97,28.93 C4.1 35.84,32.61 v35.66,32.79
  Bottom 1.016: JP5.1 62.36,36.85 v61.65,36.14 59.69,34.19 R8.2
  Bottom 1.27: v32.6,4.78 29.95,4.78 26.62,8.1 22.53,8.1 v20.51,10.12 20.24,10.39 20.24,13.41 v16.83,16.83 15.7,17.96 C10.+ 15.7,20.78 v19.67,24.75 20.32,25.4 22.55,25.4 v26.42,29.29
A0  (via drill 0.3)
  Top 0.406: U1.23 34.29,41.88 35.04,41.13 35.04,37.53 35.57,36.99 35.57,34.66 35.05,34.14 v35.05,34.09 | v50.77,6.83 50.77,2.56 JP1.A0
  Bottom 0.406: v35.05,34.09 33.55,34.09 33.27,33.81 33.12,33.81 32.82,33.5 32.28,33.5 31.75,32.97 31.75,26.44 38.79,19.41 40.62,19.41 42.49,17.53 42.49,9.42 45.09,6.83 v50.77,6.83
A1  (via drill 0.3)
  Top 0.406: U1.24 31.75,41.27 32.99,40.03 v32.99,34.57 | v53.34,6.1 JP1.A1
  Bottom 0.406: v32.99,34.57 32.56,34.14 32.03,34.14 31.11,33.22 31.11,26.19 38.53,18.77 40.34,18.77 41.86,17.25 41.86,9.17 44.83,6.2 50.39,6.2 50.49,6.1 v53.34,6.1
A2  (via drill 0.3)
  Top 0.406: U1.25 29.21,40.64 30.48,39.37 v30.48,34.59 | v55.88,5.33 JP1.A2
  Bottom 0.406: v30.48,34.59 30.48,25.93 38.28,18.14 40.08,18.14 41.22,16.99 41.22,8.91 44.58,5.56 50.16,5.56 50.29,5.44 52.96,5.44 53.06,5.33 v55.88,5.33
A3  (via drill 0.3)
  Top 0.406: U1.26 26.67,40.01 27.91,38.76 v27.91,34.62 | v58.42,4.6 JP1.A3
  Bottom 0.406: v27.91,34.62 27.91,33.63 28.22,33.33 28.22,26.49 28.93,25.78 29.74,25.78 38.02,17.5 39.83,17.5 40.59,16.74 40.59,8.66 44.32,4.93 49.94,4.93 50.09,4.78 52.76,4.78 52.86,4.67 55.5,4.67 55.58,4.6 v58.42,4.6
A4  (via drill 0.3)
  Top 0.406: JP1.SDA 21.34,48.51 21.72,48.13 23.37,48.13 24.13,47.37 U1.27 24.13,38.63 25.38,37.39 v25.38,34.62 | R10.1 39.08,19.24 39.47,18.85 v39.47,16.79 | v60.96,3.86 JP1.A4
  Top 0.813: Q3.3 37.91,19.3 R10.1
  Bottom 0.406: v25.38,34.62 25.91,34.09 26.54,34.09 27.58,33.05 27.58,26.24 28.68,25.15 29.49,25.15 37.85,16.79 v39.47,16.79 39.65,16.79 39.95,16.48 39.95,8.41 44.07,4.29 49.68,4.29 49.86,4.12 52.58,4.12 52.65,4.04 55.3,4.04 55.4,3.94 58.06,3.94 58.14,3.86 v60.96,3.86
A5  (via drill 0.3)
  Top 0.406: JP1.SCL 18.8,49.15 19.81,48.13 20.83,48.13 21.59,47.37 U1.28 21.59,38.41 20.45,37.26 v20.45,28.4 | v18.49,25.68 19.89,25.68 v21.34,24.23 | v29.41,24.21 30.3,25.09 v34.31,25.09 | v36.6,24.13 36.32,24.13 35.92,23.72 35.92,23.13 Q5.3 35.9,22.57 36.2,22.28 37.96,22.28 R12.1 39.13,22.26 39.75,21.64 v39.75,20.12
  Bottom 0.406: v20.45,28.4 20.45,27.25 18.87,25.68 v18.49,25.68 | v21.34,24.23 21.46,24.11 29.31,24.11 v29.41,24.21 | v36.6,24.13 35.33,24.13 34.42,25.04 v34.31,25.09 | v39.75,20.12 40.82,20.12 43.13,17.78 43.13,9.68 45.34,7.47 50.37,7.47 50.49,7.59 51.05,7.59 51.82,6.83 53.62,6.83 54.36,6.1 54.38,6.1 54.41,6.07 56.19,6.07 56.95,5.31 62.43,5.31 63.5,4.24 JP1.A5
AREF
  Top 0.406: JP1.AREF 23.88,49.66 24.77,48.77 29.03,48.77 29.65,48.15 31.29,48.15 31.93,47.51 33.58,47.51 34.21,46.88 35.87,46.88 36.49,46.25 38.12,46.25 38.72,45.66 38.98,45.66 39.34,45.29 39.34,43.59 U1.21
CS_3V3
  Top 0.254: U6.A5 43.92,15.49 41.58,15.49 41.15,15.06 41.15,14.17 39.37,12.39 37.11,12.39 34.11,9.4 34.11,9.04 33.72,8.65 U5.6
  Top 0.305: U6.A13 U6.A5
D0  (via drill 0.3)
  Top 0.305: U2.2 18.52,32.13 v19.58,33.2
  Bottom 0.305: v19.58,33.2 19.76,33.07 20.57,33.07 21.11,33.6 23.72,33.6 24.13,34.01 U1.2
  Bottom 0.406: U1.2 24.13,37.64 24.71,38.23 46.71,38.23 47.65,39.17 50.24,39.17 50.39,39.32 58.04,39.32 60.6,41.88 60.6,47.62 61.52,48.54 62.64,48.54 63.5,49.4 JP1.D0
D1  (via drill 0.3)
  Top 0.305: U2.3 17.4,33.4 v18.11,32.69 | v26.67,32.92 U1.3
  Top 0.406: U1.3 v26.67,38.96
  Bottom 0.305: v18.11,32.69 18.26,32.54 20.78,32.54 21.31,33.07 26.54,33.05 v26.67,32.92
  Bottom 0.406: v26.67,38.96 26.77,38.86 46.46,38.86 47.4,39.8 49.99,39.8 50.16,39.98 57.78,39.98 59.97,42.16 59.97,47.9 60.96,48.9 JP1.D1
D2  (via drill 0.3)
  Top 0.305: U6.B11 U6.B3 | v57.12,37.39 57.12,40.69 v57.23,40.79
  Top 0.406: U1.4 v29.21,39.6
  Bottom 0.305: U6.B11 | U6.B11 56.9,20.55 56.9,21.84 56.36,22.38 56.36,24.16 56.87,24.66 56.87,37.13 v57.12,37.39
  Bottom 0.406: v29.21,39.6 29.31,39.5 46.2,39.5 47.14,40.44 49.73,40.44 49.91,40.62 57.05,40.62 v57.23,40.79 57.51,41.07 57.99,41.07 59.33,42.42 59.33,47.95 58.42,48.87 JP1.D2 58.4,50.77
D3  (via drill 0.3)
  Top 0.305: U6.B10 U6.B2 | v58.12,37.39 58.12,40.92 v57.1,41.94
  Top 0.406: U1.5 v31.75,40.23
  Bottom 0.305: U6.B10 57.94,21.54 56.9,22.58 56.9,23.95 57.4,24.46 57.4,36.68 v58.12,37.39
  Bottom 0.406: v31.75,40.23 31.85,40.13 45.95,40.13 46.89,41.07 49.48,41.07 49.68,41.27 56.44,41.27 v57.1,41.94 57.96,41.94 58.7,42.67 58.7,47.7 57.86,48.54 56.74,48.54 55.88,49.4 JP1.D3
D4  (via drill 0.3)
  Top 0.305: U6.B9 U6.B1 | v48.62,41.78 48.84,41.58 48.84,39.67 50.11,38.41 50.11,37.95 50.8,37.26 50.8,34.95 52.17,33.58 55.17,33.58 55.4,33.35 v58.17,33.35
  Top 0.406: U1.6 v34.29,40.84
  Bottom 0.305: U6.B9 57.94,33.12 v58.17,33.35 | v48.62,41.78 48.62,41.76 48.26,42.11
  Bottom 0.406: v34.29,40.84 34.37,40.77 45.7,40.77 46.63,41.71 47.85,41.71 48.26,42.11 48.26,44.63 49.58,45.95 52.88,45.95 53.34,46.41 JP1.D4
D5  (via drill 0.3)
  Top 0.254: v51.71,25.68 51.71,25.17 48.64,22.1 48.64,13.36 47.8,12.52 40.97,12.52 39.05,10.6 U5.14 36.64,10.6 36.02,9.98 36.02,7.75 35.53,7.26 34.52,7.26 34.04,6.78 30.49,6.78 R2.1
  Top 0.305: 30.65,6.6 R2.1
  Top 0.406: v50.8,46.79 v50.8,38.51
  Bottom 0.254: v51.71,25.68 49.05,28.35 49.05,32.77 46.99,34.82 U1.11
  Bottom 0.406: JP1.D5 v50.8,46.79 | v50.8,38.51 47.88,38.51 46.99,37.62 U1.11
D6  (via drill 0.3)
  Top 0.254: v39.19,8 47.8,8 49.61,9.8 49.61,21.67 52.4,24.46 v52.93,24.46 | U5.7 33.73,8 v34.8,9.07
  Top 0.406: U1.12 49.53,38.18 48.26,39.45 48.26,41.07 47.9,41.43 47.9,42.14 48.26,42.49 v48.26,46.14
  Bottom 0.254: v52.93,24.46 52.35,25.04 52.35,25.96 51.99,26.31 51.74,26.31 49.53,28.52 U1.12 | v34.8,9.07 38.12,9.07 v39.19,8
  Bottom 0.406: JP1.D6 v48.26,46.14
D7  (via drill 0.3)
  Top 0.406: v45.72,45.16 45.72,42.32 47.62,40.41 47.62,39.19 48.77,38.05 v48.77,37.8
  Top 0.813: JP5.2 61.2,44.01 59.74,42.55 59.74,38.15 R8.1
  Bottom 0.406: 52.09,35.97 U1.13 52.07,37.47 | JP1.D7 v45.72,45.16 | v48.77,37.8 51.74,37.8 52.07,37.47 | R8.1 52.7,38.1 52.07,37.47
D8  (via drill 0.3)
  Top 0.406: U1.14 54.61,41.06 55.74,42.19 55.74,44.73 55.26,45.21 55.26,46.99 53.39,48.84 42.8,48.84 42.27,49.38 41.99,49.38 41.66,49.71 JP1.D8 | R7.2 12.5,27.96 12.39,27.86 | 12.72,27.96 12.7,27.94 12.41,27.94 U4.3 12.37,27.89 12.37,37.67 12.65,37.95 v12.7,37.95
  Top 0.457: U4.3 14.3,27.87 R7.2
  Bottom 0.406: v12.7,37.95 17.88,37.95 21.61,41.68 24.77,41.68 25.38,42.29 25.38,45.49 26.62,46.74 28.12,46.74 28.75,47.37 40.54,47.37 41.66,48.49 JP1.D8
D9  (via drill 0.3)
  Top 0.254: U7.8 30.8,14.24 v29.03,16 | v29.08,21.61 28.75,21.95 28.75,25.55 29.11,25.91 36.6,25.91 38.96,28.27 v38.96,28.37 | v38.05,37.41 38.05,38.56 38.53,39.04 41.27,39.04 42.67,40.44 42.67,41.99 43.18,42.49 v43.18,44.86
  Top 0.406: JP1.D9 39.12,49.71 40.06,48.77 41.83,48.77 v42.39,48.21 53.11,48.21 54.61,46.71 U1.15
  Bottom 0.254: v29.03,16 29.27,16.24 29.27,21.43 v29.08,21.61 | v38.96,28.37 38.73,28.6 38.73,34.06 38.05,34.75 v38.05,37.41 | v42.39,48.21 42.72,47.8 43.18,47.35 v43.18,44.86
D10
  Top 0.406: JP1.D10 36.58,49.71 37.52,48.77 39.14,48.77 39.78,48.13 41.45,48.13 42.09,47.5 51.31,47.5 52.07,46.74 U1.16
D11  (via drill 0.3)
  Top 0.254: U5.3 33.47,10.6 v33.48,10.59 | v39.06,9.93 41.22,9.93 41.81,10.52 47.8,10.52 49.12,11.84 49.12,21.89 52.91,25.68 55.14,25.68 56.62,27.15 61.21,27.15 61.7,26.67 64.9,26.67
  Top 0.305: v56.01,45.62 56.01,45.26 56.31,44.96 56.31,36.35 59.18,33.48 61.39,33.48 v62.05,32.82 | 64.9,26.67 JP3.4
  Top 0.406: JP1.D11 34.04,49.71 34.98,48.77 36.63,48.77 37.26,48.13 38.89,48.13 39.51,47.51 41.2,47.51 41.85,46.86 48.87,46.86 49.51,46.23 49.51,43.59 U1.17
  Bottom 0.254: v33.48,10.59 38.41,10.59 v39.06,9.93
  Bottom 0.305: U1.17 49.53,44.88 50.01,45.36 55.75,45.36 v56.01,45.62 | v62.05,32.82 62.05,30.05 62.89,29.21 64.9,29.21 JP3.4
D12  (via drill 0.3)
  Top 0.254: U6.A10 47.37,21.51 51.05,25.2 51.05,25.93 51.46,26.34 v54.86,26.34
  Top 0.305: U6.A10 U6.A2 | v45.41,41.55 45.67,41.55 47.04,40.18 47.04,38.96 48.08,37.92 48.08,37.47 48.28,37.26 48.28,34.95 49.1,34.14 50.85,34.14 52.09,32.89 v54.86,32.89 55.12,32.64 61.16,32.64 62.48,31.32 62.79,31.32 JP3.1
  Top 0.406: JP1.D12 31.5,49.71 32.44,48.77 34.09,48.77 34.72,48.13 36.37,48.13 37.01,47.5 38.63,47.5 39.24,46.89 40.93,46.89 41.59,46.23 46.51,46.23 46.99,45.74 U1.18
  Bottom 0.254: v54.86,26.34 54.86,30.23 54.86,31.09 v54.86,32.89
  Bottom 0.305: U1.18 46.99,43.13 v45.41,41.55 | v54.86,32.89 54.86,32.97
D13  (via drill 0.3)
  Top 0.254: v33.45,9.3 U5.5
  Top 0.305: U1.19 44.45,41.55 45.9,40.11 45.9,34.75 46.51,34.14 48.34,34.14 48.87,33.6 50.62,33.6 51.87,32.36 54.43,32.36 54.69,32.11 60.96,32.11 61.98,31.09 61.98,29.59 JP3.3
  Top 0.406: JP1.D13 28.96,49.73 29.92,48.77 31.55,48.77 32.18,48.13 33.83,48.13 34.47,47.5 36.12,47.5 36.74,46.88 38.38,46.88 38.98,46.28 40.66,46.27 41.33,45.61 44.03,45.61 44.45,45.19 U1.19 | R4.2 21.72,30.43 22.86,31.57 v22.86,47.37 | v24.03,30.71 24.03,22.89 v24.66,22.25 | v28.25,14.17 28.93,13.49 v30.28,13.49
  Bottom 0.254: v30.28,13.49 30.28,12.45 33.43,9.3 v33.45,9.3
  Bottom 0.406: v22.86,47.37 27.86,47.37 28.98,48.49 28.98,50.77 JP1.D13 | R4.2 22.78,29.46 v24.03,30.71 | v24.66,22.25 24.84,22.43 29.29,22.43 29.82,21.89 29.82,15.75 v28.25,14.17
D+  (via drill 0.3)
  Top 0.305: v13.72,35.94 U2.5 | J1.D+1 v6.6,38.35
  Bottom 0.305: v13.72,35.94 13.02,36.64 8.32,36.64 v6.6,38.35
D-  (via drill 0.3)
  Top 0.305: v13.72,37.21 U2.6 | v6.59,39.18 6.18,39.18 6.01,39 J1.D-1
  Bottom 0.305: v13.72,37.21 8.48,37.21 7.29,38.41 7.29,38.61 6.72,39.18 v6.59,39.18
GND  (via drill 0.3)
  Top 0.254: 32.72,17.5 29.06,17.27 v28.17,16.03
  Top 0.305: 35.38,14.4 35.38,14.25 | J1.GND1 4.7,37.05 4.98,36.78 4.98,36.14 v4.9,36.07
  Top 0.406: 32.96,17.25 32.72,17.5 | 35.38,14.25 U7.12 | U7.5 32.96,15.86 33.35,15.47 | U7.2 35.36,15.86 35.05,15.49 35.1,15.24 | 35.1,15.24 35.13,15.11 35.38,14.86 35.38,14.4 | U7.4 33.76,15.54 33.88,15.42 34.92,15.42 35.1,15.24
  other vias: 7.75,39.17 39.95,6.78 24.87,25.43 23.6,21.62 53.34,34.9 63.02,32.82 25.65,25.45 35.43,46 34.62,46 46.48,23.55 47.19,23.55 46.56,9.5 47.32,9.5 56.24,11.53 55.47,11.53 55.98,34.87 11.3,48.9 17.07,30.86 8.79,16.56 9.7,16.56 19,10.69 32.23,6.02 36.6,6.02 63.45,12.29 63.45,11.51 63.47,10.67 63.42,9.88 63.68,15.6 62.89,15.6 62.1,15.6 65.43,23.57 66.45,23.57 52.55,47.37 57.12,43.1 46.86,16.46 63.12,9.14 62.59,8.51 61.87,8.08 61.04,8.03 60.2,8.03 59.39,8.03 35.05,8.1 16.1,26.92 24.92,5 25.65,30.78 17.4,49
  pour Top (rank 6): 0,53.34 0,0 68.58,0 68.58,53.34
  pour Bottom (rank 4): 68.58,53.34 68.58,0 0,0 0,53.34
MOSI_3V3
  Top 0.254: U5.2 34.62,11.25 36.73,13.36 38.99,13.36 40.18,14.55 40.18,15.44 40.66,15.93 40.66,17.27 41.15,17.75 41.15,19.07 41.55,19.48 43.91,19.48 U6.A3
  Top 0.305: U6.A11 U6.A3
N$1
  Top 0.813: U1.9 41.91,32.11 Q1.2
  Top 1.016: C2.2 42.11,29.87 Q1.2
N$2
  Top 0.813: U1.10 44.45,32.36 Q1.1
  Top 1.016: C3.2 44.45,29.82 Q1.1
N$3
  Top 0.406: U2.7 14.35,38.48 13.72,39.12 13.72,41.91 Q2.2 13.02,44.72 C6.2
N$4
  Top 0.406: U2.8 15.39,42.27 Q2.1 15.76,44.69 C7.2
N$5  (via drill 0.3)
  Top 0.305: U2.4 13.34,34.67 v13.11,34.44 | v5,33.96 5,34.04 5.33,34.37 6.11,34.37 C5.1
  Bottom 0.305: v13.11,34.44 5.49,34.44 v5,33.96
N$6
  Top 0.61: R4.1 27.43,27.56 27.43,23.24 26.7,22.5 26.7,21.41 26.06,20.78 24.97,20.78 LED1.A
N$7
  Top 0.406: LED2.A 27.43,16.1 27.43,22.12 28.19,22.89 28.19,25.78 R1.1
N$8
  Top 0.305: U2.13 8.97,34.67 8.84,34.8 8.84,36.42 8.69,36.58 C8.2
N$9  (via drill 0.3)
  Top 1.27: U3.2 D2.A
  other vias: 1.27,23.42 2.54,23.42 3.81,23.42 5.08,23.42 6.35,23.42 1.27,22.15 1.27,20.88 1.27,19.61 1.27,18.34 1.27,17.07 2.54,17.07 3.81,17.07 5.08,17.07 6.35,17.07
  pour Bottom: 0.33,16 0.33,24.36 7.37,24.36 7.37,16
  pour Top: 0.33,24.36 0.33,16 7.37,16 7.37,19.46 9.8,19.46 9.8,21.23 7.37,21.23 7.37,24.36
N$10  (via drill 0.3)
  Top 0.305: J1.VBUS1 v2.9,39.65
  Top 0.61: F1.2 4.03,30.33 v2.29,32.07
  Bottom 0.61: v2.29,32.07 2.29,39.06 2.87,39.65 v2.9,39.65
N$11
  Top 0.305: U6.B16 U6.B8
  Top 1.27: U6.B8 61.05,9.51 arc90 61.98,10.44 61.98,13.08 arc-90 JP2.1 X1.P
N$13
  Bottom 1.778: D1.A 17.02,6.38 13.23,10.16 13.23,10.19 J3.1
N$25
  Top 0.305: U6.A15 U6.A7
N$30
  Top 0.305: U6.B13 U6.B5
N$31
  Top 0.305: U6.B14 U6.B6
RESET  (via drill 0.3)
  Top 0.305: C8.1 6.13,37.15 v5.64,37.64 | JP1.RESET 31.27,4.29 29.77,4.29 26.42,7.64 23.67,7.64 22.12,9.2 22.12,25.86 22.76,26.49 v22.76,30.45 | v33.88,5.92 34.72,6.76 38.91,6.76 39.65,7.49 48.01,7.49 50.11,9.6 50.11,21.46 52.43,23.77 53.21,23.77 54.61,25.17 55.35,25.17 56.82,26.64 60.98,26.64 62.23,25.4 JP3.5
  Top 0.813: U1.1 21.59,32.13 R3.1
  Bottom 0.305: S1.3 4.75,43.92 4.75,38.1 5.21,37.64 v5.64,37.64 6.58,37.64 8.13,36.09 12.6,36.09 16.69,32 R3.1 22.76,30.96 v22.76,30.45 | v33.88,5.92 33.88,3.4 JP1.RESET
RST_3V3
  Top 0.254: U5.15 38.89,11.25 41.17,13.51 U6.A6
SCK_3V3
  Top 0.254: U5.4 33.98,9.95 36.91,12.88 39.17,12.88 40.66,14.38 40.66,15.24 41.15,15.72 41.15,17.09 41.55,17.5 43.93,17.5 U6.A4
  Top 0.305: U6.A12 U6.A4
SCL_3V3  (via drill 0.3)
  Top 0.305: U7.14 37.16,15.37 37.52,15.01 v38,15.01 | 32.74,22.26 32.64,22.16 31.92,22.16 31.83,22.07 v31.83,21.23
  Top 0.61: R11.1 32.74,22.26 33.6,22.26 Q5.2
  Bottom 0.305: v38,15.01 38,15.82 32.59,21.23 v31.83,21.23
SDA_3V3  (via drill 0.3)
  Top 0.305: U7.13 37.79,14.23 v38,14.02 | v32.69,19.28 32.69,18.48 32.72,18.45
  Top 0.61: R9.1 32.72,18.45 33.6,18.45 Q3.2
  Bottom 0.305: v38,14.02 38,14.07 37.34,14.73 37.34,15.75 33.81,19.28 v32.69,19.28
USB_VCC  (via drill 0.3)
  Top 0.305: U2.16 8.87,30.86 8.46,30.45 7.96,30.45 F1.1
  Top 0.508: D3.A 5.51,28.09 6.71,29.29 7.44,29.29 7.82,29.67 7.82,30.32 F1.1 | R1.2 20.14,26.92 17.8,29.26 14.86,29.26 v13.26,30.86 | v11.28,30.86 U2.16
  Bottom 0.508: v13.26,30.86 v11.28,30.86
VBAT
  Top 1.27: PAD1.1 4.48,4.67 J2.2 12.1,4.66 12.85,5.41 15.06,5.41 17.93,2.54 D4.A
VIN  (via drill 0.3)
  Top 0.813: D1.C 25.91,2.16 27.1,0.96 44.15,0.96 JP1.VIN
  Top 1.422: v11.46,22.86 U3.3 v12.55,22.84
  Bottom 1.676: D1.C 21.13,6.38 15.7,11.81 15.7,12.04 C1.+ 15.72,15.47 13.61,17.58 13.61,21.79 12.78,22.63 v12.55,22.84 v11.46,22.86

### Text on the board
tNames: ~ | ~ | ~ | ~ | ~ | ~ | RESET | SENSOR | U2 | ICSP | y | z | x | ANT | 6-12V / DC IN | + | 3.5- / 4.5V / BAT
bNames: | UNO | More info on: / dramco.be/dramco-uno / by Guus Leenders | Engineering Technology / Electronics / ICT / Campus Ghent